# Altium schematic sheet MCU.SCHDOC
size A4; SheetNumber: 2; SheetTotal: 6
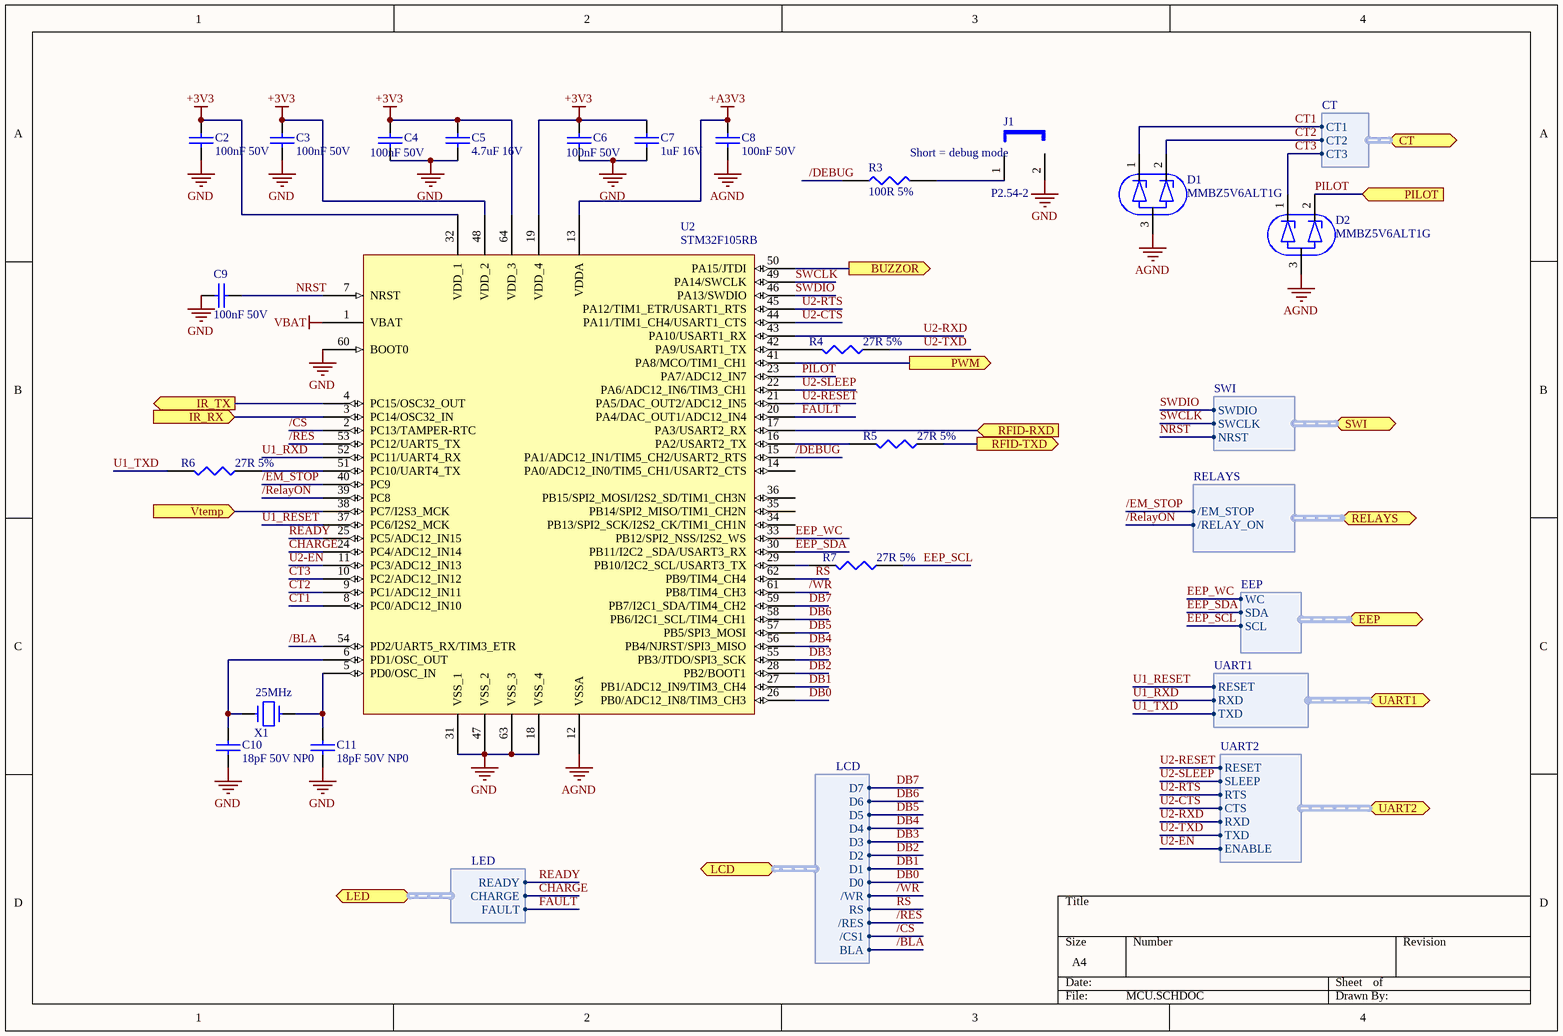
[diagram p0: MCU.SCHDOC]

## Parts
C2  100nF 50V  [CAPC2012N]
C3  100nF 50V  [CAPC2012N]
C4  100nF 50V  [CAPC2012N]
C5  4.7uF 16V  [CAPC2012N]
C6  100nF 50V  [CAPC2012N]
C7  1uF 16V  [CAPC2012N]
C8  100nF 50V  [CAPC2012N]
C9  100nF 50V  [CAPC2012N]
C10  18pF 50V NP0  [CAPC2012N]
C11  18pF 50V NP0  [CAPC2012N]
D1  MMBZ5V6ALT1G  [SOT23-3N]
D2  MMBZ5V6ALT1G  [SOT23-3N]
J1  P2.54-2  [JP2-P2.54]
R3  100R 5%  [RESC2012N]
R4  27R 5%  [RESC2012N]
R5  27R 5%  [RESC2012N]
R6  27R 5%  [RESC2012N]
R7  27R 5%  [RESC2012N]
U2  STM32F105RB  [TQFP64_M]
X1  25MHz  [ATSM-49]

## Ports
BUZZOR (out), CT (harness CT), EEP (harness EEP), IR_RX (in), IR_TX (out), LCD (harness LCD), LED (harness LED), PILOT (in), PWM (out), RELAYS (harness RELAYS), RFID-RXD (in), RFID-TXD (out), SWI (harness SWI), UART1 (harness UART1), UART2 (harness UART2), Vtemp (in)

## Harnesses
SWI: SWDIO, SWCLK, NRST
UART2: ENABLE, TXD, RXD, CTS, RTS, SLEEP, RESET
RELAYS: /EM_STOP, /RELAY_ON
LCD: D7, D6, D5, D4, D3, D2, D1, D0, /WR, RS, /RES, /CS1, BLA
LED: READY, CHARGE, FAULT
EEP: WC, SDA, SCL
CT: CT1, CT2, CT3
UART1: TXD, RXD, RESET

## Nets
+3V3: C2.1 C3.1 C4.1 C5.1 C6.1 C7.1 U2.19(VDD_4) U2.32(VDD_1) U2.48(VDD_2) U2.64(VDD_3)
+A3V3: C8.1 U2.13(VDDA)
AGND: C8.2 D1.3 D2.3 U2.12(VSSA)
GND: C2.2 C3.2 C4.2 C5.2 C6.2 C7.2 C9.2 C10.1 C11.1 J1.2 U2.18(VSS_4) U2.31(VSS_1) U2.47(VSS_2) U2.60(BOOT0) U2.63(VSS_3)
VBAT: U2.1(VBAT)
/BLA: U2.54(PD2/UART5_RX/TIM3_ETR) ; port LCD.BLA
/CS: U2.2(PC13/TAMPER-RTC) ; port LCD./CS1
/DEBUG: R3.1 U2.15(PA1/ADC12_IN1/TIM5_CH2/USART2_RTS)
/EM_STOP: U2.40(PC9) ; port RELAYS./EM_STOP
/RelayON: U2.39(PC8) ; port RELAYS./RELAY_ON
/RES: U2.53(PC12/UART5_TX) ; port LCD./RES
/WR: U2.61(PB8/TIM4_CH3) ; port LCD./WR
BUZZOR: U2.50(PA15/JTDI) ; port BUZZOR
CHARGE: U2.24(PC4/ADC12_IN14) ; port LED.CHARGE
CT1: D1.1 U2.8(PC0/ADC12_IN10) ; port CT.CT1
CT2: D1.2 U2.9(PC1/ADC12_IN11) ; port CT.CT2
CT3: D2.1 U2.10(PC2/ADC12_IN12) ; port CT.CT3
DB0: U2.26(PB0/ADC12_IN8/TIM3_CH3) ; port LCD.D0
DB1: U2.27(PB1/ADC12_IN9/TIM3_CH4) ; port LCD.D1
DB2: U2.28(PB2/BOOT1) ; port LCD.D2
DB3: U2.55(PB3/JTDO/SPI3_SCK) ; port LCD.D3
DB4: U2.56(PB4/NJRST/SPI3_MISO) ; port LCD.D4
DB5: U2.57(PB5/SPI3_MOSI) ; port LCD.D5
DB6: U2.58(PB6/I2C1_SCL/TIM4_CH1) ; port LCD.D6
DB7: U2.59(PB7/I2C1_SDA/TIM4_CH2) ; port LCD.D7
EEP_SCL: R7.1 ; port EEP.SCL
EEP_SDA: U2.30(PB11/I2C2__SDA/USART3_RX) ; port EEP.SDA
EEP_WC: U2.33(PB12/SPI2_NSS/I2S2_WS) ; port EEP.WC
FAULT: U2.20(PA4/DAC_OUT1/ADC12_IN4) ; port LED.FAULT
IR_RX: U2.3(PC14/OSC32_IN) ; port IR_RX
IR_TX: U2.4(PC15/OSC32_OUT) ; port IR_TX
NRST: C9.1 U2.7(NRST) ; port SWI.NRST
PILOT: D2.2 U2.23(PA7/ADC12_IN7) ; port PILOT
PWM: U2.41(PA8/MCO/TIM1_CH1) ; port PWM
READY: U2.25(PC5/ADC12_IN15) ; port LED.READY
RFID-RXD: U2.17(PA3/USART2_RX) ; port RFID-RXD
RFID-TXD: R5.1 ; port RFID-TXD
RS: U2.62(PB9/TIM4_CH4) ; port LCD.RS
SWCLK: U2.49(PA14/SWCLK) ; port SWI.SWCLK
SWDIO: U2.46(PA13/SWDIO) ; port SWI.SWDIO
U1_RESET: U2.37(PC6/I2S2_MCK) ; port UART1.RESET
U1_RXD: U2.52(PC11/UART4_RX) ; port UART1.RXD
U1_TXD: R6.2 ; port UART1.TXD
U2-CTS: U2.44(PA11/TIM1_CH4/USART1_CTS) ; port UART2.CTS
U2-EN: U2.11(PC3/ADC12_IN13) ; port UART2.ENABLE
U2-RESET: U2.21(PA5/DAC_OUT2/ADC12_IN5) ; port UART2.RESET
U2-RTS: U2.45(PA12/TIM1_ETR/USART1_RTS) ; port UART2.RTS
U2-RXD: U2.43(PA10/USART1_RX) ; port UART2.RXD
U2-SLEEP: U2.22(PA6/ADC12_IN6/TIM3_CH1) ; port UART2.SLEEP
U2-TXD: R4.1 ; port UART2.TXD
Vtemp: U2.38(PC7/I2S3_MCK) ; port Vtemp
NetC10_2: C10.2 U2.6(PD1/OSC_OUT) X1.1
NetC11_2: C11.2 U2.5(PD0/OSC_IN) X1.2
NetJ1_1: J1.1 R3.2
NetR4_2: R4.2 U2.42(PA9/USART1_TX)
NetR5_2: R5.2 U2.16(PA2/USART2_TX)
NetR6_1: R6.1 U2.51(PC10/UART4_TX)
NetR7_2: R7.2 U2.29(PB10/I2C2_SCL/USART3_TX)

Not connected (* = marked no-connect by the designer): U2 14(PA0/ADC12_IN0/TIM5_CH1/USART2_CTS) 34(PB13/SPI2_SCK/I2S2_CK/TIM1_CH1N) 35(PB14/SPI2_MISO/TIM1_CH2N) 36(PB15/SPI2_MOSI/I2S2_SD/TIM1_CH3N)

## Notes on the sheet
- (near J1) Short = debug mode

## Library data of the parts
C2-C9 = CAP: Capacitor
  C5: Price: 0.052
C10 C11 = CAP: Part Field 1: Capacitor; Part Field 3: Multilayer Ceramic; Part Field 4: SR15 Series
  C10: Part Field 2: 33pF/100V
  C11: Part Field 2: 47pF/100V
D1 D2 = PESD3V3S2UT: ESD protection diode 3.3V; Manufacturer: NXP; Price: 0.25
J1 = JUMPER: Jumper 2.54-2
R3 = RES1: Resistor; Price: 0.0025
R4-R7 = RES1
U2 = STM32F105XX: ST Cortex M3 MCU 64 pins
X1 = CRYSTAL: Price: *